# Altium project MCU036A_MSP-EXP430FR2355.PrjPcb (part 3 of 3)

## Sheet MCU036A_Target_Device.SchDoc
size 431 x 279 mm; Date: Not shown in title block; ApprovedBy: Not shown in title block; CheckedBy: Not shown in title block; Author: Not shown in title block; CompanyName: Not shown in title block; Engineer: Not shown in title block; Organization: Not shown in title block; Address1: Not shown in title block; Address2: Not shown in title block; Address3: Not shown in title block; Address4: Not shown in title block; DocumentNumber: 1; Revision: Use project parameter SCH_Rev; SheetNumber: 2; SheetTotal: 3; PageSetup: Record=PageOptions|CenterHorizontal=True|CenterVertical=True|PrintScale=1.00|XCorrection=1.00|YCorrection=1.00|PrintKind=0|BorderSize=5000000|LeftOffset=0|BottomOffset=0|Orientation=2|PaperLength=1000|PaperWidth=1000|Scale=100|PaperSource=15|PrintQuality=600|MediaType=1|DitherType=10|PaperKind=Letter|PrintScaleMode=1; CurrentTime: Not shown in title block; CurrentDate: Not shown in title block; Time: Not shown in title block; DocumentFullPathAndName: Not shown in title block; DocumentName: Not shown in title block; ModifiedDate: Not shown in title block; ImagePath: Not shown in title block
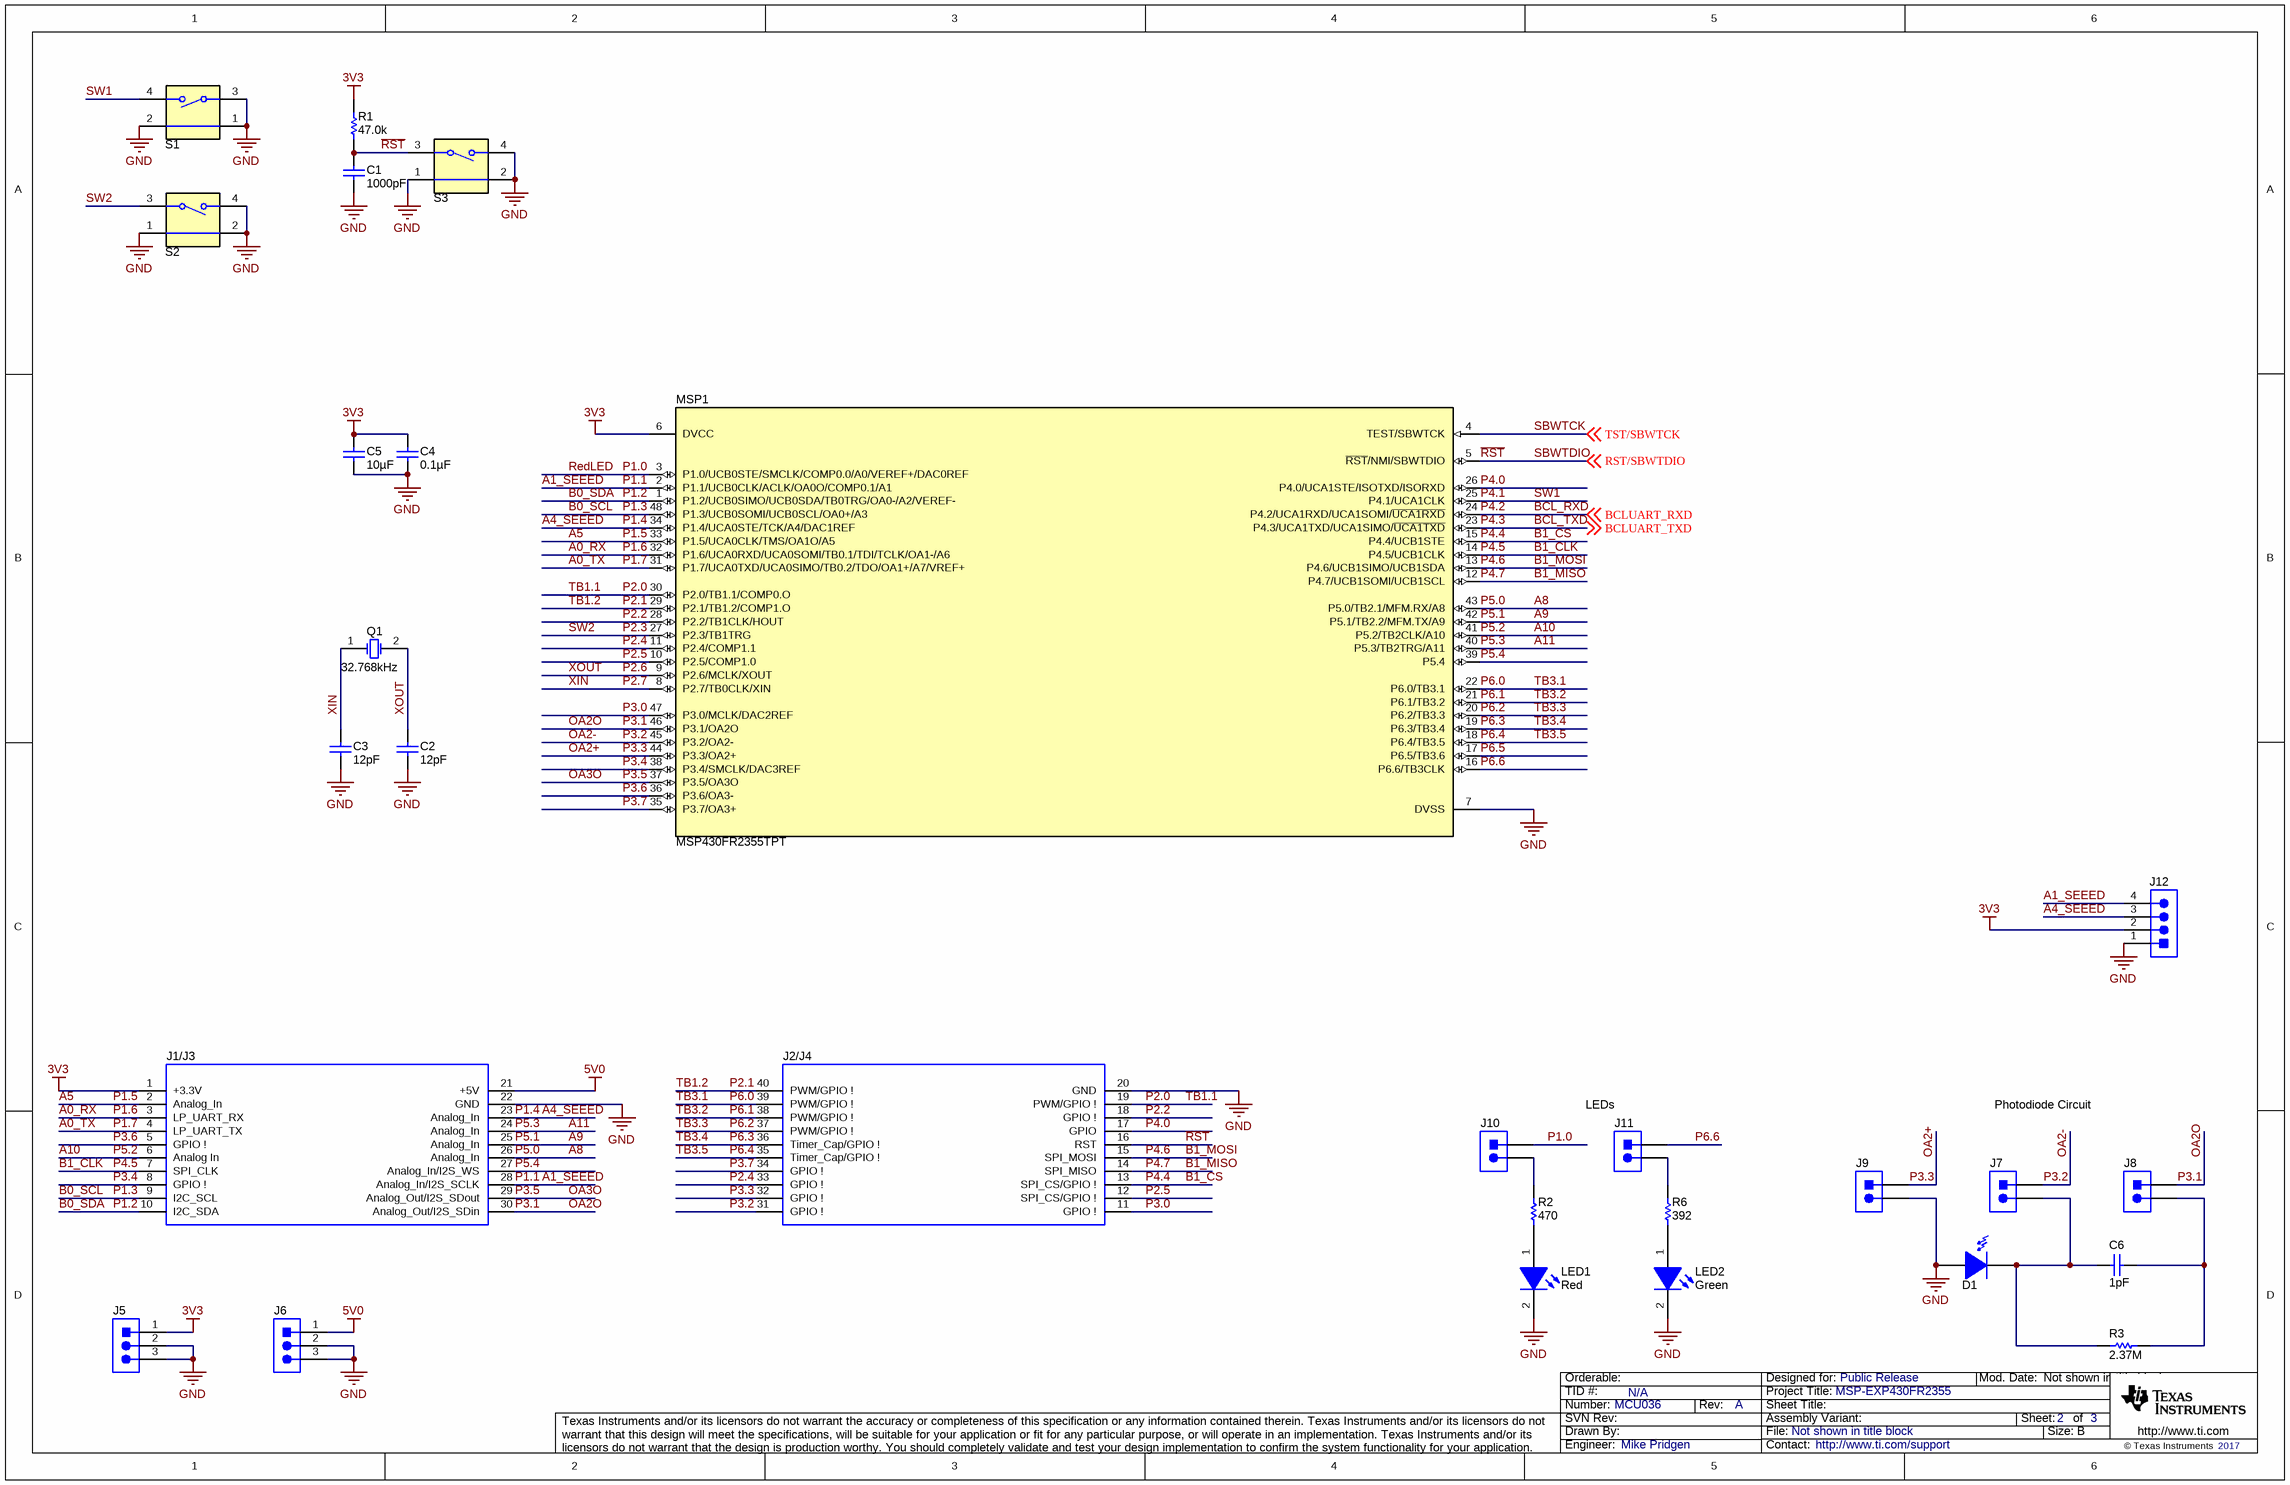
[diagram p1: MCU036A_Target_Device.SchDoc]

### Parts
C1  ValueDisplayed: 1000pF  [0402]  (hidden comment: GRM155R71H102KA01D)
C2  ValueDisplayed: 12pF  [0402]  (hidden comment: GRM1555C1E120JA01D)
C3  ValueDisplayed: 12pF  [0402]  (hidden comment: GRM1555C1E120JA01D)
C4  ValueDisplayed: 0.1µF  [0402]  (hidden comment: GRM155R61H104ME14D)
C5  ValueDisplayed: 10µF  [0603]  (hidden comment: GRM188R60J106ME84)
C6  ValueDisplayed: 1pF  [0402]  (hidden comment: GRM1555C1H1R0BA01D)
D1  SFH 2701  [SFH_2701]  (value not drawn)
J1/J3  SSQ-110-03-T-D  [BoosterPack_40pin_J1J3]  (value not drawn)
J2/J4  SSQ-110-03-T-D  [BoosterPack_40pin_J2J4]  (value not drawn)
J5  PEC03SAAN  [PEC03SAAN_Launchpad_3V3]  (value not drawn)
J6  PEC03SAAN  [PEC03SAAN_Launchpad_5V0]  (value not drawn)
J7  TSW-102-07-G-S  [TSW-102-07-G-S]  (value not drawn)
J8  TSW-102-07-G-S  [TSW-102-07-G-S]  (value not drawn)
J9  TSW-102-07-G-S  [TSW-102-07-G-S]  (value not drawn)
J10  TSW-102-07-G-S  [TSW-102-07-G-S]  (value not drawn)
J11  TSW-102-07-G-S  [TSW-102-07-G-S]  (value not drawn)
J12  110990037  [SEEED_110990037]  (value not drawn)
LED1  value Red  [LED_LTST-C190_Red]  (hidden comment: LTST-C190CKT)
LED2  value Green  [LED_LTST-C190]  (hidden comment: LTST-C190GKT)
MSP1  MSP430FR2355TPT  [PT0048A_N]
Q1  Frequency: 32.768kHz  [Epson_FC-135]  (hidden comment: ECS-.327-12.5-34B-TR)
R1  ValueDisplayed: 47.0k  [0402]  (hidden comment: RC0402FR-0747KL)
R2  ValueDisplayed: 470  [0402]  (hidden comment: RC0402FR-07470RL)
R3  ValueDisplayed: 2.37M  [0603]  (hidden comment: CRCW06032M37FKEA)
R6  ValueDisplayed: 392  [0402]  (hidden comment: CRCW0402392RFKED)
S1  1188E-1K2-V-TR  [SW_1188E]  (value not drawn)
S2  1188E-1K2-V-TR  [SW_1188E]  (value not drawn)
S3  1188E-1K2-V-TR  [SW_1188E]  (value not drawn)

### Nets
3V3: C4.1 C5.2 J1/J3.1(+3.3V) J5.1 J12.2 MSP1.6(DVCC) R1.2
5V0: J1/J3.21(+5V) J6.1
GND: C1.2 C2.2 C3.2 C4.2 C5.1 D1.2(A) J1/J3.22(GND) J2/J4.20(GND) J5.2 J5.3 J6.2 J6.3 J9.2 J12.1 LED1.2(K) LED2.2(K) MSP1.7(DVSS) S1.1 S1.2 S1.3 S2.1 S2.2 S2.4 S3.1 S3.2 S3.4
A0_RX: J1/J3.3(LP_UART_RX) MSP1.32(P1.6/UCA0RXD/UCA0SOMI/TB0.1/TDI/TCLK/OA1-/A6)  [also labelled P1.6]
A0_TX: J1/J3.4(LP_UART_TX) MSP1.31(P1.7/UCA0TXD/UCA0SIMO/TB0.2/TDO/OA1+/A7/VREF+)  [also labelled P1.7]
A1_SEEED: J1/J3.28(Analog_In/I2S_SCLK) J12.4 MSP1.2(P1.1/UCB0CLK/ACLK/OA0O/COMP0.1/A1)  [also labelled P1.1]
A4_SEEED: J1/J3.23(Analog_In) J12.3 MSP1.34(P1.4/UCA0STE/TCK/A4/DAC1REF)  [also labelled P1.4]
A5: J1/J3.2(Analog_In) MSP1.33(P1.5/UCA0CLK/TMS/OA1O/A5)  [also labelled P1.5]
A8: J1/J3.26(Analog_In) MSP1.43(P5.0/TB2.1/MFM.RX/A8)  [also labelled P5.0]
A9: J1/J3.25(Analog_In) MSP1.42(P5.1/TB2.2/MFM.TX/A9)  [also labelled P5.1]
A10: J1/J3.6(Analog_In) MSP1.41(P5.2/TB2CLK/A10)  [also labelled P5.2]
A11: J1/J3.24(Analog_In) MSP1.40(P5.3/TB2TRG/A11)  [also labelled P5.3]
B0_SCL: J1/J3.9(I2C_SCL) MSP1.48(P1.3/UCB0SOMI/UCB0SCL/OA0+/A3)  [also labelled P1.3]
B0_SDA: J1/J3.10(I2C_SDA) MSP1.1(P1.2/UCB0SIMO/UCB0SDA/TB0TRG/OA0-/A2/VEREF-)  [also labelled P1.2]
B1_CLK: J1/J3.7(SPI_CLK) MSP1.14(P4.5/UCB1CLK)  [also labelled P4.5]
B1_CS: J2/J4.13(SPI_CS/GPIO_!) MSP1.15(P4.4/UCB1STE)  [also labelled P4.4]
B1_MISO: J2/J4.14(SPI_MISO) MSP1.12(P4.7/UCB1SOMI/UCB1SCL)  [also labelled P4.7]
B1_MOSI: J2/J4.15(SPI_MOSI) MSP1.13(P4.6/UCB1SIMO/UCB1SDA)  [also labelled P4.6]
BCL_RXD: MSP1.24(P4.2/UCA1RXD/UCA1SOMI/~{UCA1RXD}) ; off-sheet BCLUART_RXD  [also labelled BCLUART_RXD, P4.2]
BCL_TXD: MSP1.23(P4.3/UCA1TXD/UCA1SIMO/~{UCA1TXD}) ; off-sheet BCLUART_TXD  [also labelled BCLUART_TXD, P4.3]
OA2+: J2/J4.32(GPIO_!) J9.1 MSP1.44(P3.3/OA2+)  [also labelled P3.3]
OA2-: J2/J4.31(GPIO_!) J7.1 MSP1.45(P3.2/OA2-)  [also labelled P3.2]
OA2O: J1/J3.30(Analog_Out/I2S_SDin) J8.1 MSP1.46(P3.1/OA2O)  [also labelled P3.1]
OA3O: J1/J3.29(Analog_Out/I2S_SDout) MSP1.37(P3.5/OA3O)  [also labelled P3.5]
P1.0: J10.1 MSP1.3(P1.0/UCB0STE/SMCLK/COMP0.0/A0/VEREF+/DAC0REF)  [also labelled RedLED]
P2.0: J2/J4.19(PWM/GPIO_!) MSP1.30(P2.0/TB1.1/COMP0.O)  [also labelled TB1.1]
P2.1: J2/J4.40(PWM/GPIO_!) MSP1.29(P2.1/TB1.2/COMP1.O)  [also labelled TB1.2]
P2.2: J2/J4.18(GPIO_!) MSP1.28(P2.2/TB1CLK/HOUT)
P2.3: MSP1.27(P2.3/TB1TRG) S2.3  [also labelled SW2]
P2.4: J2/J4.33(GPIO_!) MSP1.11(P2.4/COMP1.1)
P2.5: J2/J4.12(SPI_CS/GPIO_!) MSP1.10(P2.5/COMP1.0)
P2.6: C2.1 MSP1.9(P2.6/MCLK/XOUT) Q1.2(OSC2)  [also labelled XOUT]
P2.7: C3.1 MSP1.8(P2.7/TB0CLK/XIN) Q1.1(OSC1)  [also labelled XIN]
P3.0: J2/J4.11(GPIO_!) MSP1.47(P3.0/MCLK/DAC2REF)
P3.4: J1/J3.8(GPIO_!) MSP1.38(P3.4/SMCLK/DAC3REF)
P3.6: J1/J3.5(GPIO_!) MSP1.36(P3.6/OA3-)
P3.7: J2/J4.34(GPIO_!) MSP1.35(P3.7/OA3+)
P4.0: J2/J4.17(GPIO) MSP1.26(P4.0/UCA1STE/ISOTXD/ISORXD)
P4.1: MSP1.25(P4.1/UCA1CLK) S1.4  [also labelled SW1]
P5.4: J1/J3.27(Analog_In/I2S_WS) MSP1.39(P5.4)
P6.0: J2/J4.39(PWM/GPIO_!) MSP1.22(P6.0/TB3.1)  [also labelled TB3.1]
P6.1: J2/J4.38(PWM/GPIO_!) MSP1.21(P6.1/TB3.2)  [also labelled TB3.2]
P6.2: J2/J4.37(PWM/GPIO_!) MSP1.20(P6.2/TB3.3)  [also labelled TB3.3]
P6.3: J2/J4.36(Timer_Cap/GPIO_!) MSP1.19(P6.3/TB3.4)  [also labelled TB3.4]
P6.4: J2/J4.35(Timer_Cap/GPIO_!) MSP1.18(P6.4/TB3.5)  [also labelled TB3.5]
P6.5: MSP1.17(P6.5/TB3.6)
P6.6: J11.1 MSP1.16(P6.6/TB3CLK)
~{RST}: C1.1 J2/J4.16(RST) MSP1.5(~{RST}/NMI/SBWTDIO) R1.1 S3.3 ; off-sheet RST/SBWTDIO  [also labelled RST/SBWTDIO, SBWTDIO]
SBWTCK: MSP1.4(TEST/SBWTCK) ; off-sheet TST/SBWTCK  [also labelled TST/SBWTCK]
NetC6_1: C6.1 J8.2 R3.2
NetC6_2: C6.2 D1.1(C) J7.2 R3.1
NetJ10_2: J10.2 R2.2
NetJ11_2: J11.2 R6.2
NetLED1_1: LED1.1(A) R2.1
NetLED2_1: LED2.1(A) R6.1

### Notes on the sheet
- (near J11) LEDs
- Photodiode Circuit
- Drawn By:
- SVN Rev:
- Number:
- TID #:
- Orderable:
- Rev:
- Sheet Title:
- File:
- Project Title:
- Designed for:
- Assembly Variant:
- Mod. Date:
- Sheet:
- Size:
- of
- B
- http://www.ti.com
- Texas Instruments and/or its licensors do not warrant the accuracy or completeness of this specification or any information contained therein. Texas Instruments and/or its licensors do not warrant that this design will meet the specifications, will be suitable for your application or fit for any particular purpose, or will operate in an implementation. Texas Instruments and/or its licensors do not warrant that the design is production worthy. You should completely validate and test your design implementation to confirm the system functionality for your application.
- Engineer:
- Contact:
- © Texas Instruments

### Library data of the parts
C1 = GRM155R71H102KA01D: CAP, CERM, 1000 pF, 50 V, +/- 10%, X7R, 0402; Manufacturer: MuRata; Polarized: N; CompType: Capacitor; Value: 1000pF; U/M: EA; Cap_F: 0.000000001; Tolerance_%: 10; Value1: Unknown; VDC_V: 50; Value2: 50V; TaMin_C: -55; TaMax_C: 125; SizeArea_mm2: 0.5; SizeAreaWB_mm2: 3; SizeX_mm: 1; SizeZ_mm: 0.6; AEC Category: Q200; SymbolVersion: 2008-07-09; PartNumber: GRM155R71H102KA01D; PackageReference: 0402; RoHS: Y; MountType: SMT; Technology: Ceramic; TempCo: X7R; Cap_Case: 0402; SizeY_mm: 0.5; Published: 2008-06-19; Publisher: Texas Instruments; LatestRevisionDate: 2017-01-30; ComponentLink1Description: Datasheet link; ComponentLink1URL: http://search.murata.co.jp/Ceramy/PnsearchViewAction.do?HnOFG=ON&HnNFG=ON&SEL_CNT=50&sLang=en&sKey=GRM155R71H102KA01D&x=9&y=9&search=startwith; Supplier 1: Digi-Key; Supplier Part Number 1: 490-1303-1-ND; Supplier 2: Mouser; Supplier Part Number 2: 81-GRM36X102K50; Supplier 3: Farnell; Supplier Part Number 3: 1828882; AEC Qualified: ?
C2 C3 = GRM1555C1E120JA01D: CAP, CERM, 12 pF, 25 V, +/- 5%, C0G/NP0, 0402; Manufacturer: MuRata; Polarized: N; CompType: Capacitor; Value: 12pF; U/M: EA; Cap_F: 0.000000000012; Tolerance_%: 5; Value1: Unknown; VDC_V: 25; Value2: 25V; TaMin_C: -55; TaMax_C: 125; SizeArea_mm2: 0.5; SizeAreaWB_mm2: 3; SizeX_mm: 1; SizeZ_mm: 0.6; AEC Category: Q200; SymbolVersion: 2008-07-09; PartNumber: GRM1555C1E120JA01D; PackageReference: 0402; RoHS: Y; MountType: SMT; Technology: Ceramic; TempCo: C0G/NP0; Cap_Case: 0402; SizeY_mm: 0.5; Published: 2008-06-19; Publisher: Texas Instruments; LatestRevisionDate: 2017-01-30; ComponentLink1Description: Datasheet link; ComponentLink1URL: http://search.murata.co.jp/Ceramy/PnsearchViewAction.do?HnOFG=ON&HnNFG=ON&SEL_CNT=50&sLang=en&sKey=GRM1555C1E120JA01D&x=9&y=9&search=startwith; Supplier 1: Mouser; Supplier Part Number 1: 81-GRM1555C1E120JA1D; AEC Qualified: ?
C4 = GRM155R61H104ME14D: CAP, CERM, 0.1 µF, 50 V, +/- 20%, X5R, 0402; Manufacturer: MuRata; Polarized: N; CompType: Capacitor; Value: 0.1uF; U/M: EA; Cap_F: 0.0000001; Tolerance_%: 20; Value1: Unknown; VDC_V: 50; Value2: 50V; TaMin_C: -55; TaMax_C: 85; SizeArea_mm2: 0.5; SizeAreaWB_mm2: 3; SizeX_mm: 1; SizeZ_mm: 0.6; AEC Category: Q200; SymbolVersion: 2008-07-09; PartNumber: GRM155R61H104ME14D; PackageReference: 0402; RoHS: Y; MountType: SMT; Technology: Ceramic; TempCo: X5R; Cap_Case: 0402; SizeY_mm: 0.5; Published: 2008-06-19; Publisher: Texas Instruments; LatestRevisionDate: 2017-01-30; ComponentLink1Description: Datasheet link; ComponentLink1URL: http://search.murata.co.jp/Ceramy/image/img/A01X/G101/ENG/GRM155R61H104ME14-01.pdf; Supplier 1: Digi-Key; Supplier Part Number 1: GRM155R61H104ME14D-ND; Supplier 2: Mouser; Supplier Part Number 2: 81-GRM155R61H104ME4D; AEC Qualified: N; AEC Grade: N/A
C5 = GRM188R60J106ME84: CAP, CERM, 10 µF, 6.3 V, +/- 20%, X5R, 0603; Manufacturer: MuRata; Polarized: N; CompType: Capacitor; Value: 10uF; U/M: EA; Cap_F: 0.00001; Tolerance_%: 20; Value1: Unknown; VDC_V: 6.3; Value2: 6.3V; TaMin_C: -55; TaMax_C: 85; SizeArea_mm2: 1.28; SizeAreaWB_mm2: 4.68; SizeX_mm: 1.6; SizeY_mm: 0.8; SizeZ_mm: 1; AEC Category: Q200; SymbolVersion: 2008-07-09; PartNumber: GRM188R60J106ME84; PackageReference: 0603; RoHS: Y; MountType: SMT; Technology: Ceramic; TempCo: X5R; Cap_Case: 0603; Published: 2008-06-19; Publisher: Texas Instruments; LatestRevisionDate: 2017-01-30; ComponentLink1Description: Datasheet link; ComponentLink1URL: http://search.murata.co.jp/Ceramy/image/img/A01X/G101/ENG/GRM188R60J106ME84-01.pdf; Supplier 1: Digi-Key; Supplier Part Number 1: 490-7316-1-ND; AEC Qualified: ?
C6 = GRM1555C1H1R0BA01D: CAP, CERM, 1 pF, 50 V, +/- 10%, C0G/NP0, 0402; Manufacturer: MuRata; Polarized: N; CompType: Capacitor; Value: 1pF; U/M: EA; Cap_F: 0.000000000001; Tolerance_%: 10; Value1: Unknown; VDC_V: 50; Value2: 50V; TaMin_C: -55; TaMax_C: 125; SizeArea_mm2: 0.5; SizeAreaWB_mm2: 3; SizeX_mm: 1; SizeZ_mm: 0.6; AEC Category: Q200; SymbolVersion: 2008-07-09; PartNumber: GRM1555C1H1R0BA01D; PackageReference: 0402; RoHS: Y; MountType: SMT; Technology: Ceramic; TempCo: C0G/NP0; Cap_Case: 0402; SizeY_mm: 0.5; Published: 2008-06-19; Publisher: Texas Instruments; LatestRevisionDate: 2017-01-30; ComponentLink1Description: Datasheet link; ComponentLink1URL: http://psearch.murata.com/capacitor/product/GRM1555C1H1R0BA01%23.pdf; Supplier 1: Digi-Key; Supplier Part Number 1: 490-6206-1-ND; Supplier 2: Mouser; Supplier Part Number 2: 81-GRM1555C1H1R0BA1D; AEC Qualified: ?
D1 = CMP-0002013-3: High Speed PIN Photodiode, SMD; Manufacturer: OSRAM; Value: 820nm; ComponentLink1Description: Datasheet URL; Supplier 2: Mouser; Supplier 1: Digi-Key; Supplier Part Number 1: 475-2967-1-ND; Supplier Part Number 2: 720-SFH2701; PartNumber: SFH 2701; PackageReference: 3.2x1.5mm; CompType: Photodiode; MountType: SMT; ComponentLink1URL: http://www.osram-os.com/Graphics/XPic9/00083297_0.pdf
J1/J3 = BoosterPack_40pin_J1J3: Receptacle, 2.54mm, 10x2, Tin, TH; Manufacturer: Samtec; Alternate Manufacturer: Major League Electronics; Alternate PartNumber: CRD-081413-A-G; SymbolCreator: a0412235; Note: Booster Pack 40 pin J1 and J3; SymbolVersion: 2015-10-21; CompType: Receptacle; PartNumber: SSQ-110-03-T-D; RoHS: Y; PackageReference: 10x2 Receptacle; MountType: TH; ComponentLink1Description: Datasheet Link; Publisher: Texas Instruments; LatestRevisionDate: 2017-02-01; Supplier 1: Digi-Key; Supplier Part Number 1: SAM1204-10-ND
J2/J4 = BoosterPack_40pin_J2J4: Receptacle, 2.54mm, 10x2, Tin, TH; Manufacturer: Samtec; Alternate Manufacturer: Major League Electronics; Alternate PartNumber: CRD-081413-A-G; SymbolCreator: a0412235; Note: Booster Pack 40 pin J2 and J4; SymbolVersion: 2015-10-21; CompType: Receptacle; PartNumber: SSQ-110-03-T-D; RoHS: Y; PackageReference: 10x2 Receptacle; MountType: TH; ComponentLink1Description: Datasheet Link; Publisher: Texas Instruments; LatestRevisionDate: 2017-02-01; Supplier 1: Digi-Key; Supplier Part Number 1: SAM1204-10-ND
J5 J6 = PEC03SAAN: Header, 100mil, 3x1, Tin, TH; Manufacturer: Sullins Connector Solutions; SymbolCreator: a0799628; Pitch_mm: 2.54; Gender: Male; Shrouded: N; Row_Count: 1; Current_A: 3; Voltage_V: 1800; Cert_UL: Y; SymbolVersion: 2013-03-28; PartNumber: PEC03SAAN; PackageReference: Header, 3 PIN, 100mil, Tin; ClassName: Header; CompType: Header; RoHS: Y; MountType: TH; ComponentLink1Description: Datasheet URL; ComponentLink1URL: http://www.sullinscorp.com/catalogs/77_PAGE108-109_.100_MALE_HDR.pdf; Orientation: Vertical; PinCount: 3; ContactFinish: Tin; Color: Black; Publisher: Texas Instruments; LatestRevisionDate: 2017-03-02; Supplier 1: Digi-Key; Supplier Part Number 1: S1012E-03-ND
J7-J11 = TSW-102-07-G-S: Header, 100mil, 2x1, Gold, TH; Manufacturer: Samtec; SymbolCreator: a0412235; Pitch_mm: 2.54; Gender: Male; Shrouded: N; Row_Count: 1; Current_A: 6.3; Voltage_V: 550; Cert_CSA: Y; SymbolVersion: 2013-10-31; PartNumber: TSW-102-07-G-S; PackageReference: 2x1 Header; ClassName: Header; CompType: Header; RoHS: Y; MountType: TH; ComponentLink1Description: Datasheet URL; ComponentLink1URL: http://samtec.com/ftppub/pdf/TSW_TH.PDF; Orientation: Vertical; PinCount: 2; ContactFinish: Gold; Color: Black; Cert_UL: Y; Cert_CULUS: N; Cert_VDE: N; Publisher: Texas Instruments; LatestRevisionDate: 2016-01-07; Supplier 1: Digi-Key; Supplier Part Number 1: SAM1029-02-ND
J12 = 110990037: Header(shrouded), 2mm, 4x1, Tin, R/A, TH; Manufacturer: SEEED; SymbolCreator: a0412235; Pitch_mm: 2; Gender: Male; Shrouded: Y; Row_Count: 1; Voltage_V: 250; SymbolVersion: 2013-08-30; PartNumber: 110990037; PackageReference: Header(shrouded), 2mm, 4x1, R/A, TH; CompType: Header; RoHS: Y; MountType: TH; ComponentLink1Description: Datasheet URL; ComponentLink1URL: https://statics3.seeedstudio.com/images/opl/datasheet/3470140P1.pdf; Orientation: R/A; PinCount: 4; ContactFinish: Tin; Color: White; Current_A: 2; Cert_UL: Y; Publisher: Texas Instruments; LatestRevisionDate: 2017-02-17; Supplier 1: Digi-Key; Supplier Part Number 1: 1597-1083-ND; Supplier 2: Mouser; Supplier Part Number 2: 713-110990037
LED1 = LTST-C190CKT: LED, Red, SMD; Manufacturer: Lite-On; Vf_V: 2; Value2: 2V; Io_A: 0.02; Tjmax_C: 85; Power_TotalModule: 0.0625; Value1: 0.0625W; U/M: EA; SymbolVersion: 2017-01-11; PartNumber: LTST-C190CKT; PackageReference: Red LED, 1.6x0.8x0.8mm; RoHS: Y; CompType: LED; Type: ?; MountType: SMT; Color: red; Published: 2008-07-11; Publisher: Texas Instruments; ComponentLink1URL: http://optoelectronics.liteon.com/en-us/api/DwonloadFileHandler.ashx?txtSpecNo=DS-22-98-0009&txtPartNo=LTST-C190CKT; ComponentLink1Description: Datasheet link; LatestRevisionDate: 2017-02-06; Supplier 1: Digi-Key; Supplier Part Number 1: 160-1181-1-ND; Supplier 2: Mouser; Supplier Part Number 2: 859-LTST-C190CKT
LED2 = LTST-C190GKT: LED, Green, SMD; Manufacturer: Lite-On; Vf_V: 2.1; Value2: 2.1V; Io_A: 0.02; Power_TotalModule: 0.1; Value1: 0.1W; U/M: EA; SymbolVersion: 2017-01-11; PartNumber: LTST-C190GKT; PackageReference: 1.6x0.8x0.8mm; RoHS: Y; CompType: LED; Type: ?; MountType: SMT; Color: green; Published: 2008-07-11; Publisher: Texas Instruments; ComponentLink1URL: https://sps06.itg.ti.com/sites/KMS/crossdivteams/altium/docs/ComponentDatasheets/LTST-C190GKT.pdf; ComponentLink1Description: Datasheet link; LatestRevisionDate: 2017-02-06; Supplier 1: Digi-Key; Supplier Part Number 1: 160-1183-1-ND; Supplier 2: Mouser; Supplier Part Number 2: 859-LTST-C190GKT
MSP1 = MSP430FR2355IPT: Mixed-Signal Microcontroller, PT0048A (LQFP-48); Alternate PartNumber: XMS430FR2355TPT; Manufacturer: Texas Instruments; SymbolCreator: Altium; SizeArea_mm2: 81; SizeAreaWB_mm2: 121; SizeX_mm: 9; SizeZ_mm: 1.6; CompType: IC; U/M: EA; SymbolVersion: 2017-01-06; PartNumber: MSP430FR2355TPT; PackageReference: PT0048A; PackageDescription: LQFP-48; MountType: SMT; SizeY_mm: 9; ComponentLink1Description: Datasheet Link; ComponentLink1URL: https://sps06.itg.ti.com/sites/KMS/crossdivteams/altium/docs/ComponentDatasheets/SLASEC4_MSP430FR2355.int.1.0.pdf; Publisher: Texas Instruments; LatestRevisionDate: 2017-02-07; Alternate Manufacturer: Texas Instruments
Q1 = X1A0001410014: Crystal, 32.768 KHz, 12.5 pF, SMD; Manufacturer: ECS Inc.; SymbolCreator: a0412235; U/M: EA; TaMin_C: -40; TaMax_C: 85; SymbolVersion: 2008-07-09; PartNumber: ECS-.327-12.5-34B-TR; CompType: Crystal; PackageReference: SMD, 2-Leads, Body 3.2x1.5mm; MountType: SMT; RoHS: Y; ComponentLink1Description: Datasheet Link; ComponentLink1URL: http://www.ecsxtal.com/store/pdf/ecx-31b.pdf; Publisher: Texas Instruments; LatestRevisionDate: 2017-02-02
R1 = RC0402FR-0747KL: RES, 47.0 k, 1%, 0.0625 W, 0402; Manufacturer: Yageo America; CompType: Resistor; Value: 47.0k; Res_ohm: 47000; Value_Code: 47k0; Tolerance_%: 1; Power_W: 0.0625; VDC_V: 50; TempCo: 100 ppm/C; SizeArea_mm2: 0.5; SizeZ_mm: 0.6; U/M: EA; AEC Category: Q200; AEC Qualified: N; SymbolVersion: 2009-05-29; PartNumber: RC0402FR-0747KL; PackageReference: 0402; RoHS: Y; Value1: 1%; Value2: 0.0625W; MountType: SMT; Technology: Thick Film; SizeX_mm: 1; SizeY_mm: 0.5; Published: 2008-06-26; Publisher: Texas Instruments; LatestRevisionDate: 2017-01-28; ComponentLink1Description: Datasheet link; ComponentLink1URL: http://www.yageo.com/documents/recent/PYu-RC0402_51_RoHS_L_6_r.pdf; Supplier 1: Digi-Key; Supplier Part Number 1: 311-47.0KLRCT-ND; Supplier 2: Newark; Supplier Part Number 2: 67R9937; Supplier 3: Mouser; Supplier Part Number 3: 603-RC0402FR-0747KL; AEC Grade: N/A
R2 = RC0402FR-07470RL: RES, 470, 1%, 0.063 W, 0402; Manufacturer: Yageo America; CompType: Resistor; Value: 470; Value_Code: 470R; Tolerance_%: 1; Power_W: 0.063; Value2: 0.063W; VDC_V: 50; TempCo: 100 ppm/C; SizeArea_mm2: 0.5; SizeZ_mm: 0.6; U/M: EA; AEC Category: Q200; AEC Qualified: N; SymbolVersion: 2009-05-29; PartNumber: RC0402FR-07470RL; PackageReference: 0402; RoHS: Y; Res_ohm: 470; Value1: 1%; MountType: SMT; Technology: Thick Film; SizeX_mm: 1; SizeY_mm: 0.5; Published: 2008-06-26; Publisher: Texas Instruments; LatestRevisionDate: 2017-01-28; ComponentLink1Description: Datasheet link; ComponentLink1URL: http://www.yageo.com/documents/recent/PYu-RC_Group_51_RoHS_L_04.pdf; Supplier 1: Digi-Key; Supplier Part Number 1: 311-470LRCT-ND; Supplier 2: Newark; Supplier Part Number 2: 67R9940; Supplier 3: Mouser; Supplier Part Number 3: 603-RC0402FR-07470RL; AEC Grade: N/A
R3 = CRCW06032M37FKEA: RES, 2.37 M, 1%, 0.1 W, 0603; Manufacturer: Vishay-Dale; CompType: Resistor; Value: 2.37Meg; Res_ohm: 2370000; Value_Code: 2M37; Tolerance_%: 1; Power_W: 0.1; Value2: 0.1W; VDC_V: 75; TempCo: 100 ppm/C; SizeArea_mm2: 1.28; SizeX_mm: 1.6; SizeY_mm: 0.8; EIA_Code: E96; U/M: EA; AEC Category: Q200; SymbolVersion: 2009-05-29; PartNumber: CRCW06032M37FKEA; PackageReference: 0603; RoHS: Y; Value1: 1%; MountType: SMT; Technology: Thick Film; SizeZ_mm: 1; Published: 2008-06-26; Publisher: Texas Instruments; LatestRevisionDate: 2017-01-27; ComponentLink1Description: Datasheet link; ComponentLink1URL: http://www.vishay.com/docs/20035/dcrcwe3.pdf; Supplier 1: Digi-Key; Supplier Part Number 1: 541-2.37MHCT-ND; Supplier 2: Newark; Supplier 3: Mouser; Supplier Part Number 3: 71-CRCW06032M37FKEA; AEC Qualified: ?
R6 = CRCW0402392RFKED: RES, 392, 1%, 0.063 W, 0402; Manufacturer: Vishay-Dale; CompType: Resistor; Value: 392; Value_Code: 392R; Tolerance_%: 1; Power_W: 0.063; Value2: 0.063W; VDC_V: 50; TempCo: 100 ppm/C; SizeArea_mm2: 0.5; SizeZ_mm: 0.6; EIA_Code: E96; U/M: EA; AEC Category: Q200; SymbolVersion: 2009-05-29; PartNumber: CRCW0402392RFKED; PackageReference: 0402; RoHS: Y; Res_ohm: 392; Value1: 1%; MountType: SMT; Technology: Thick Film; SizeX_mm: 1; SizeY_mm: 0.5; Published: 2008-06-26; Publisher: Texas Instruments; LatestRevisionDate: 2017-01-28; ComponentLink1Description: Datasheet link; ComponentLink1URL: http://www.vishay.com/docs/20035/dcrcwe3.pdf; Supplier 1: Digi-Key; Supplier Part Number 1: 541-392LCT-ND; Supplier 2: Newark; Supplier Part Number 2: 52K7033; Supplier 3: Mouser; Supplier Part Number 3: 71-CRCW0402-392-E3; AEC Qualified: ?
S1-S3 = 1188E-1K2-V-TR: Switch, SPST, 0.05 A, 12 VDC, SMD; Manufacturer: Diptronics; SymbolCreator: Altium; SizeAreaWB_mm2: 53.9; SizeArea_mm2: 27.3; SizeX_mm: 7.8; SizeY_mm: 3.5; VDC_V: 12; PositionCount: 1; CurrentRating_mA: 50; SymbolVersion: 2017-02-06; PartNumber: 1188E-1K2-V-TR; MountType: SMT; SizeZ_mm: 3.5; ComponentLink1Description: Datasheet URL; ComponentLink1URL: http://www.dip.com.tw/en/en-product-information/en-switch004/item/download/1976_b080c057386714e3a6604cbe658b9df3; RoHS: Y; Circuit: SPST; Orientation: Side Actuated; CompType: Switch; PackageReference: 7.8x3.5mm; Publisher: Texas Instruments; LatestRevisionDate: 2017-02-07

## Sheet MCU036A_Hardware.SchDoc
size 431 x 279 mm; Date: Not shown in title block; ApprovedBy: Not shown in title block; CheckedBy: Not shown in title block; Author: Not shown in title block; CompanyName: Not shown in title block; Engineer: Not shown in title block; Organization: Not shown in title block; Address1: Not shown in title block; Address2: Not shown in title block; Address3: Not shown in title block; Address4: Not shown in title block; DocumentNumber: 1; Revision: Use project parameter SCH_Rev; SheetNumber: 3; SheetTotal: 3; PageSetup: Record=PageOptions|CenterHorizontal=True|CenterVertical=True|PrintScale=1.00|XCorrection=1.00|YCorrection=1.00|PrintKind=0|BorderSize=5000000|LeftOffset=0|BottomOffset=0|Orientation=2|PaperLength=1000|PaperWidth=1000|Scale=100|PaperSource=15|PrintQuality=600|MediaType=1|DitherType=10|PaperKind=Letter|PrintScaleMode=1; CurrentTime: Not shown in title block; CurrentDate: Not shown in title block; Time: Not shown in title block; DocumentFullPathAndName: Not shown in title block; DocumentName: Not shown in title block; ModifiedDate: Not shown in title block; ImagePath: Not shown in title block
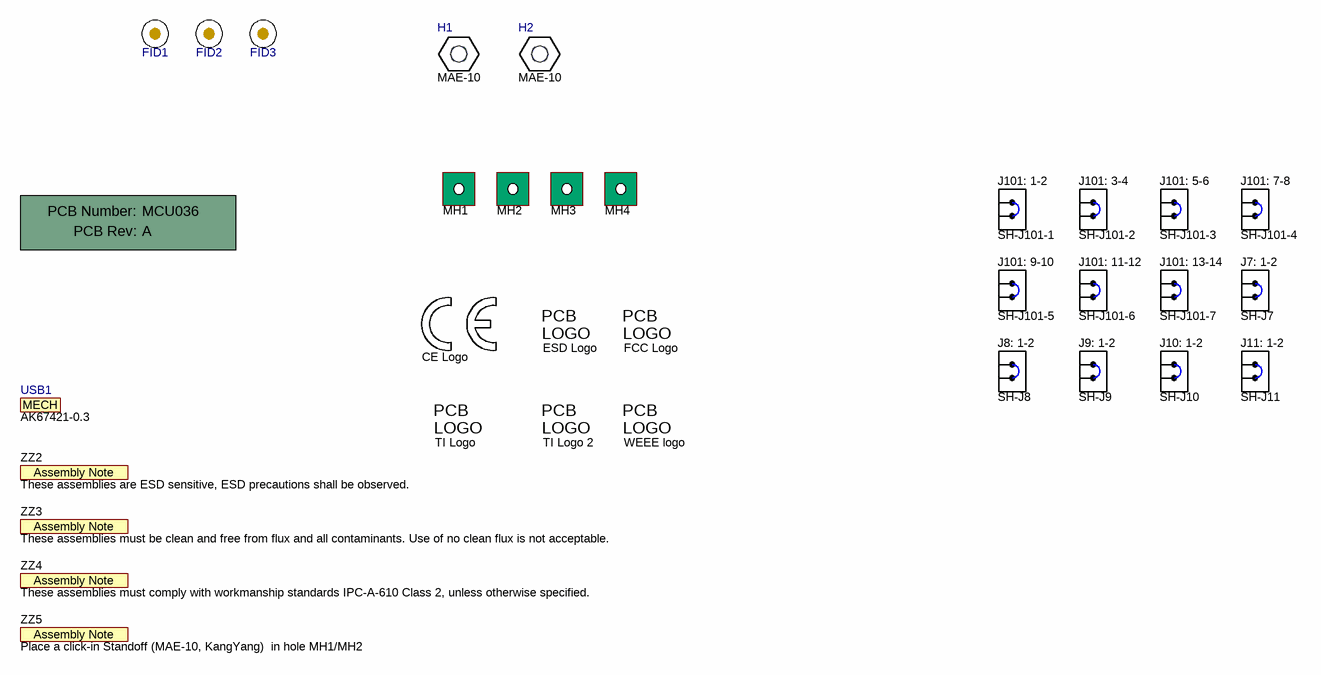
[diagram p2: MCU036A_Hardware.SchDoc]

### Parts
!PCB  Printed Circuit Board  (value not drawn)  (mechanical)
CE_Logo  CE Mark  [CE_Mark_5mm]  (value not drawn)  (no BOM)
ESD_Logo  ESD Susceptible  [ESD_Overlay_Medium]  (value not drawn)  (no BOM)
FCC_Logo  FCC disclaimer  [FCC_disclaimer]  (value not drawn)  (no BOM)
FID1  Fiducial  [Fiducial6.4-20]  (value not drawn)
FID2  Fiducial  [Fiducial6.4-20]  (value not drawn)
FID3  Fiducial  [Fiducial6.4-20]  (value not drawn)
H1  MAE-10  [KY_MAE-10]
H2  MAE-10  [KY_MAE-10]
MH1  MTG_NoPads  [NPTH125mil]  (value not drawn)  (no BOM)
MH2  MTG_NoPads  [NPTH125mil]  (value not drawn)  (no BOM)
MH3  MTG_NoPads  [NPTH125mil]  (value not drawn)  (no BOM)
MH4  MTG_NoPads  [NPTH125mil]  (value not drawn)  (no BOM)
SH-J7  Note: J7: 1-2  [SNT-100-BK-G]  (hidden comment: 969102-0000-DA)
SH-J8  Note: J8: 1-2  [SNT-100-BK-G]  (hidden comment: 969102-0000-DA)
SH-J9  Note: J9: 1-2  [SNT-100-BK-G]  (hidden comment: 969102-0000-DA)
SH-J10  Note: J10: 1-2  [SNT-100-BK-G]  (hidden comment: 969102-0000-DA)
SH-J11  Note: J11: 1-2  [SNT-100-BK-G]  (hidden comment: 969102-0000-DA)
SH-J101-1  Note: J101: 1-2  [SNT-100-BK-G]  (hidden comment: 969102-0000-DA)
SH-J101-2  Note: J101: 3-4  [SNT-100-BK-G]  (hidden comment: 969102-0000-DA)
SH-J101-3  Note: J101: 5-6  [SNT-100-BK-G]  (hidden comment: 969102-0000-DA)
SH-J101-4  Note: J101: 7-8  [SNT-100-BK-G]  (hidden comment: 969102-0000-DA)
SH-J101-5  Note: J101: 9-10  [SNT-100-BK-G]  (hidden comment: 969102-0000-DA)
SH-J101-6  Note: J101: 11-12  [SNT-100-BK-G]  (hidden comment: 969102-0000-DA)
SH-J101-7  Note: J101: 13-14  [SNT-100-BK-G]  (hidden comment: 969102-0000-DA)
TI_Logo  Texas Instruments  [TI_Symbol_Overlay_Medium]  (value not drawn)  (no BOM)
TI_Logo_2  Texas Instruments  [TI_Horizontal_Overlay_Small]  (value not drawn)  (no BOM)
USB1  AK67421-0.3  (mechanical)
WEEE_Logo  WEEE logo  [WEEE_Minimum]  (no BOM)
ZZ2  These assemblies are ESD sensitive, ESD precautions shall be observed.  [AssemblyNote]  (no BOM)
ZZ3  These assemblies must be clean and free from flux and all contaminants. Use of no clean flux is not acceptable.  [AssemblyNote]  (no BOM)
ZZ4  These assemblies must comply with workmanship standards IPC-A-610 Class 2, unless otherwise specified.  [AssemblyNote]  (no BOM)
ZZ5  Place a click-in Standoff (MAE-10, KangYang)  in hole MH1/MH2  [AssemblyNote]  (no BOM)

### Notes on the sheet
- Drawn By:
- SVN Rev:
- Number:
- TID #:
- Orderable:
- Rev:
- Sheet Title:
- File:
- Project Title:
- Designed for:
- Assembly Variant:
- Mod. Date:
- Sheet:
- Size:
- of
- B
- http://www.ti.com
- Texas Instruments and/or its licensors do not warrant the accuracy or completeness of this specification or any information contained therein. Texas Instruments and/or its licensors do not warrant that this design will meet the specifications, will be suitable for your application or fit for any particular purpose, or will operate in an implementation. Texas Instruments and/or its licensors do not warrant that the design is production worthy. You should completely validate and test your design implementation to confirm the system functionality for your application.
- Engineer:
- Contact:
- © Texas Instruments
- (in symbol AssemblyNote) Assembly Note
- (in symbol CMP-0074769-1) PCB; LOGO
- (in symbol CMP-0077983-1) MECH
- (in symbol ESD_Susceptible) PCB; LOGO
- (in symbol FCC_disclaimer) PCB; LOGO
- (in symbol PCB) PCB Number:; PCB Rev:
- (in symbol TI_Logo) PCB; LOGO

### Library data of the parts
!PCB = PCB: Manufacturer: Any; PartNumber: MCU036; SymbolCreator: a0412235; SymbolVersion: 2012-05-30; CompType: PCB; RoHS: O; MountType: N/A; Publisher: Texas Instruments; LatestRevisionDate: 2012-06-27; LatestRevisionNote: Initial Version; Alternate Manufacturer: -; Alternate PartNumber: -
CE_Logo = CE Mark: SymbolCreator: a0412235; SymbolVersion: 2014-07-08; Published: 2009-03-03; Publisher: Texas Instruments; LatestRevisionDate: 2016-03-21
ESD_Logo = ESD_Susceptible: ESD Susceptible Symbol; SymbolCreator: a0412235; SymbolVersion: 2011-08-22; Published: 2009-03-03; Publisher: Texas Instruments; LatestRevisionDate: 2016-03-21
FCC_Logo = FCC_disclaimer: SymbolCreator: a0412235; SymbolVersion: 2016-03-21; Published: 2009-03-03; Publisher: Texas Instruments; LatestRevisionDate: 2016-03-21
FID1-FID3 = Fiducial: Fiducial mark.  There is nothing to buy or mount.; SymbolCreator: codlsc; SymbolVersion: 2009-11-4; CompType: Fiducial; PackageReference: N/A; ClassName: FiducialMark; Manufacturer: N/A; PartNumber: N/A; MountType: N/A; Publisher: Texas Instruments; LatestRevisionDate: 2017-05-31; LatestRevisionNote: Added Alternate PartNumber and Alternate Manufacturer parameters to appropriate components.
H1 H2 = CMP-0077978-1: Spacer Support, Nylon 66; Manufacturer: Kang Yang; CompType: Standoff; PartNumber: MAE-10; Key: MAE-10; PackageReference: Spacer Nylon Support; ComponentLink1Description: Datasheet Link; MountType: N/A; ComponentLink1URL: https://sps16.itg.ti.com/sites/KMS/crossdivteams/altium/docs/ComponentDatasheets/1104004000018---MAE-10.pdf; RoHS: Y
MH1-MH4 = Mounting Hole (non-standard) No Pad: PCB Mounting Hole, No Pad; Manufacturer: Any; SymbolCreator: a0412235; SymbolVersion: 2013-12-26; CompType: Mounting Hole; PartNumber: N/A; PackageReference: Mounting Hole; MountType: N/A; Publisher: Texas Instruments; LatestRevisionDate: 2017-01-25
SH-J7-SH-J11 SH-J101-1-SH-J101-7 = 969102-0000-DA: Shunt, 100mil, Gold plated, Black; Manufacturer: 3M; Alternate Manufacturer: Samtec; Value: 1x2; ClassName: Shunt; CompType: Shunt; PartNumber: 969102-0000-DA; RoHS: Y; PackageReference: Shunt; MountType: N/A; ComponentLink1Description: Datasheet Link; ComponentLink1URL: http://multimedia.3m.com/mws/mediawebserver?66666UuZjcFSLXTtNxTElXf6EVuQEcuZgVs6EVs6E666666--; Publisher: Texas Instruments; LatestRevisionDate: 2016-03-03; Alternate PartNumber: SNT-100-BK-G; Supplier 1: Digi-Key; Supplier Part Number 1: 3M9580-ND; Supplier 2: Mouser; Supplier Part Number 2: 517-9691020000DA
TI_Logo TI_Logo_2 = TI_Logo: Texas Instrument Corporate Signature; SymbolCreator: a0412235; SymbolVersion: 2011-08-22; ClassName: Logo; Published: 2009-03-03; Publisher: Texas Instruments; LatestRevisionDate: 2016-03-21
USB1 = CMP-0077983-1: Cable, USB-A to micro USB-B, 0.3 m; Manufacturer: Assman WSW; ComponentLink1URL: http://www.assmann-wsw.com/fileadmin/datasheets/ASS_7091_CA.pdf; Key: AK67421-0.3; CompType: Cable; Supplier 1: Digi-Key; RoHS: Y; Supplier Part Number 1: AE11229-ND; PartNumber: AK67421-0.3; MountType: N/A; ComponentLink1Description: Datasheet Link
WEEE_Logo = CMP-0074769-1: Library Reference: WEEE logo; Lib Reference: WEEE logo; PartNumber: WEEE logo
ZZ2-ZZ5 = AssemblyNote: SymbolCreator: codlsc; SymbolVersion: 2010-05-18; CompType: AssemblyNote; ClassName: AssemblyNote; Publisher: Texas Instruments; LatestRevisionDate: 2012-06-14; LatestRevisionNote: Initial Version; Alternate Manufacturer: -; Alternate PartNumber: -

## Nets that join several sheets
3V3: MCU036A_eZFET_1.4 (J101.10), MCU036A_Target_Device (7 pins)
5V0: MCU036A_eZFET_1.4 (J101.12), MCU036A_Target_Device (J1/J3.21 J6.1)
GND: MCU036A_eZFET_1.4 (J101.14), MCU036A_Target_Device (26 pins)
BCL_RXD: MCU036A_eZFET_1.4 (J101.8), MCU036A_Target_Device (MSP1.24)
BCL_TXD: MCU036A_eZFET_1.4 (J101.6), MCU036A_Target_Device (MSP1.23)
~{RST}: MCU036A_eZFET_1.4 (J101.4), MCU036A_Target_Device (5 pins)
SBWTCK: MCU036A_eZFET_1.4 (J101.2), MCU036A_Target_Device (MSP1.4)

## Assembly variants
001: not fitted C127 FID1 FID2 FID3 MH1 MH2 MH3 MH4 TP101 TP102 TP103 TP104 TP105 TP106 TP107 TP108 TP109